# EAGLE schematic tritiled22_cr2354_lux_c (EAGLE 8.2.2)
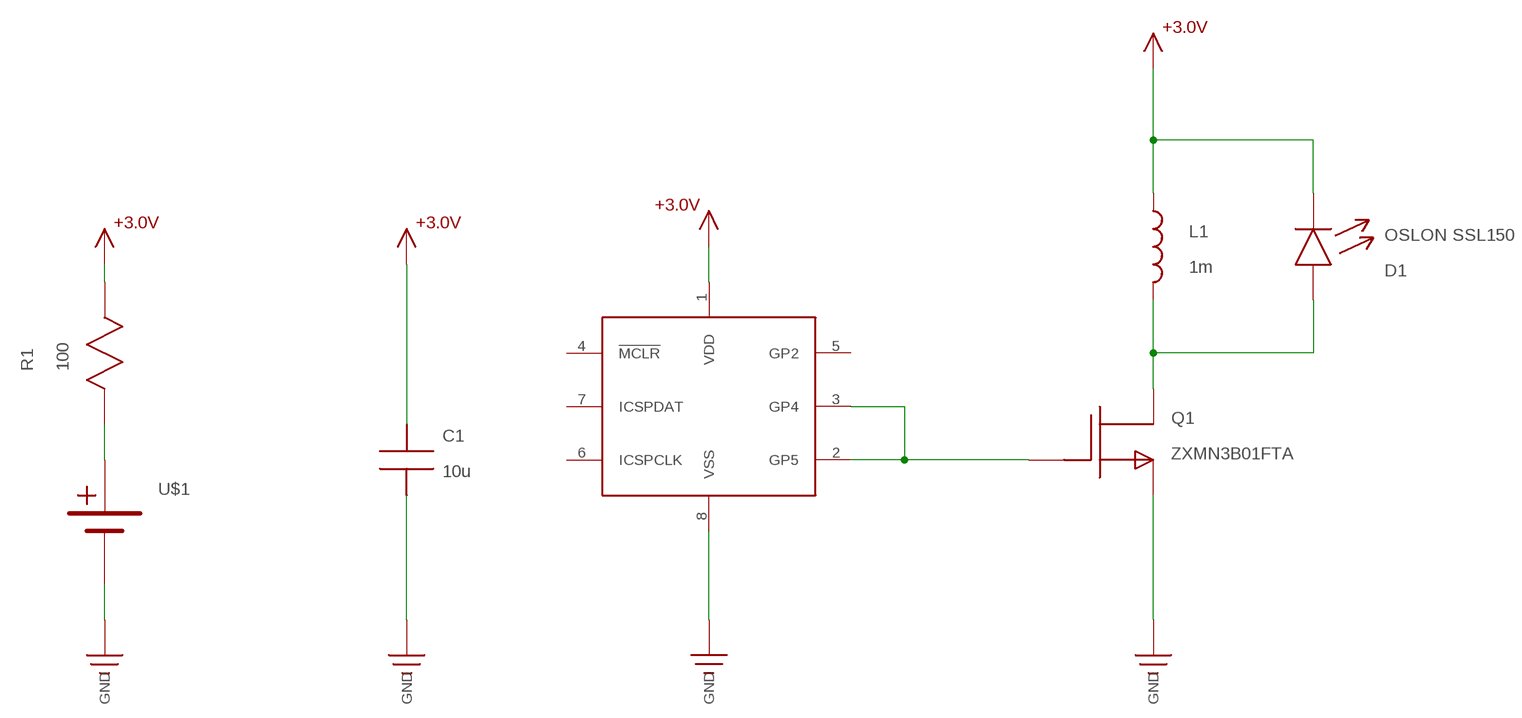
[diagram p0: schematic, sheet 1]

## Parts
C1  10u  C1206  [1206]
D1  OSLON SSL150  LEDLUXEON_C  [LUXEON_C]
L1  1m  SRR6028_INDUCTOR  [SRR6028_INDUCTOR]
Q1  ZXMN3B01FTA  ZXMN3B01FSOT23  [SOT-23]
R1  100  R1206  [R1206]
U1  PIC12LF1571  [SOIC8]
U$1  CR2354_TABBED  [CR2354_TABBED]

## Nets
+3.3V: C1.P$1 D1.C L1.P$1 R1.P$2 U1.1(VDD) ; supply symbol labelled +3.0V
GND: C1.P$2 Q1.2(S) U1.8(VSS) U$1.GND(0V)
N$5: D1.A L1.P$2 Q1.3(D)
N$8: Q1.1(G) U1.2(GP5) U1.3(GP4)
VBATT: R1.P$1 U$1.+3V(+V)
Unconnected: U1.4(!MCLR!) U1.5(GP2) U1.6(ICSPCLK) U1.7(ICSPDAT)

## Library data of the parts
C1 = tritiled:C
D1 = tritiled:LED
L1 = tritiled:SRR6028_INDUCTOR
Q1 = tritiled:ZXMN3B01F
R1 = tritiled:R
U1 = tritiled:PIC12LF1571
U$1 = tritiled:CR2354_TABBED